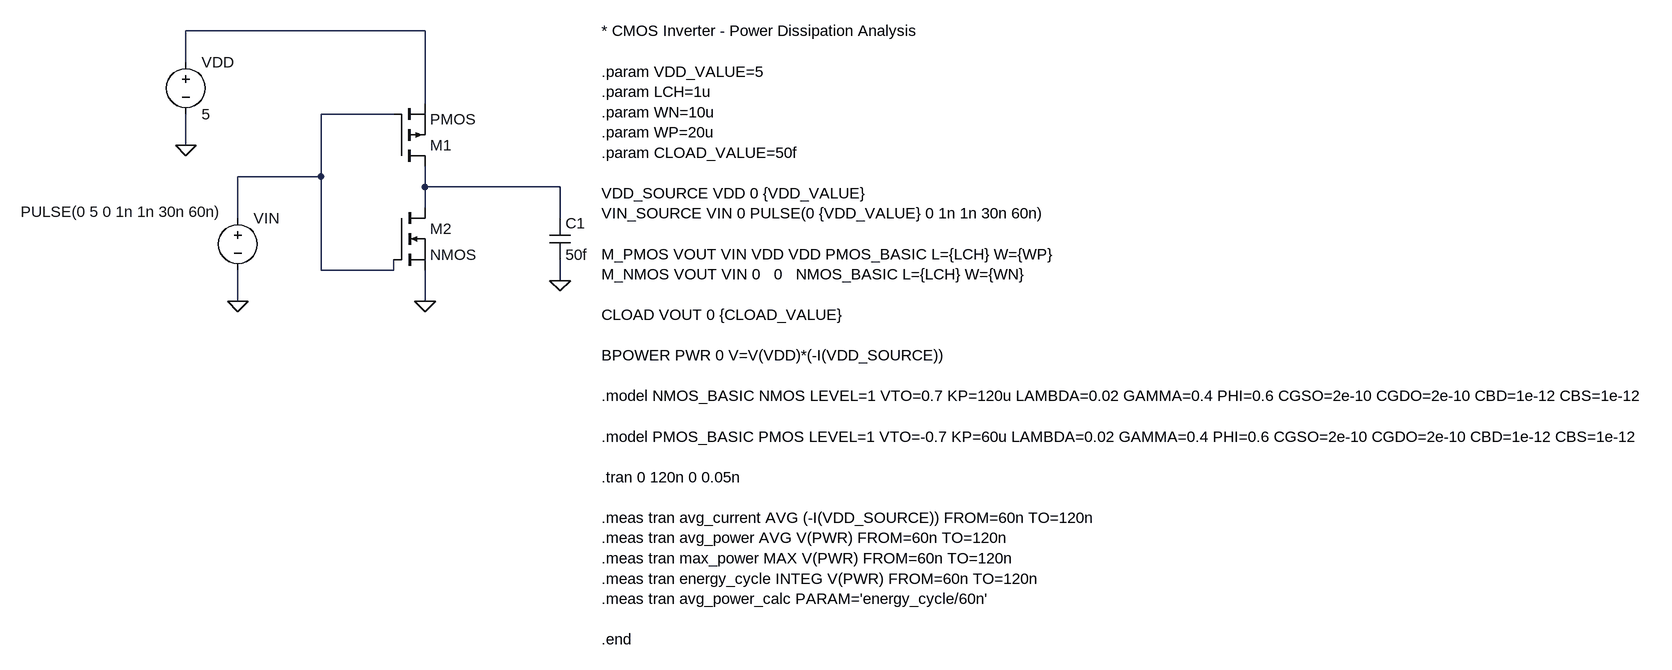
[diagram p0: schematic circuit.asc]
circuit.asc, the LTspice schematic file:
Version 4.1
SHEET 1 2120 776
WIRE 160 -80 -208 -80
WIRE -208 -32 -208 -80
WIRE 160 32 160 -80
WIRE 112 48 0 48
WIRE -208 96 -208 48
WIRE 0 144 0 48
WIRE 0 144 -128 144
WIRE 160 160 160 128
WIRE 368 160 160 160
WIRE 160 192 160 160
WIRE -128 208 -128 144
WIRE 368 208 368 160
WIRE 0 288 0 144
WIRE 112 288 112 272
WIRE 112 288 0 288
WIRE 368 304 368 272
WIRE -128 336 -128 288
WIRE 160 336 160 288
FLAG -208 96 0
FLAG 160 336 0
FLAG -128 336 0
FLAG 368 304 0
SYMBOL pmos 112 128 M180
SYMATTR InstName M1
SYMBOL nmos 112 192 R0
SYMATTR InstName M2
SYMBOL voltage -208 -48 R0
WINDOW 123 0 0 Left 0
WINDOW 39 0 0 Left 0
SYMATTR InstName VDD
SYMATTR Value 5
SYMBOL voltage -128 192 R0
WINDOW 3 -334 6 Left 2
WINDOW 123 0 0 Left 0
WINDOW 39 0 0 Left 0
SYMATTR InstName VIN
SYMATTR Value PULSE(0 5 0 1n 1n 30n 60n)
SYMBOL cap 352 208 R0
SYMATTR InstName C1
SYMATTR Value 50f
TEXT 432 -80 Left 2 !* CMOS Inverter - Power Dissipation Analysis\n \n.param VDD_VALUE=5\n.param LCH=1u\n.param WN=10u\n.param WP=20u\n.param CLOAD_VALUE=50f\n \nVDD_SOURCE VDD 0 {VDD_VALUE}\nVIN_SOURCE VIN 0 PULSE(0 {VDD_VALUE} 0 1n 1n 30n 60n)\n \nM_PMOS VOUT VIN VDD VDD PMOS_BASIC L={LCH} W={WP}\nM_NMOS VOUT VIN 0   0   NMOS_BASIC L={LCH} W={WN}\n \nCLOAD VOUT 0 {CLOAD_VALUE}\n \nBPOWER PWR 0 V=V(VDD)*(-I(VDD_SOURCE))\n \n.model NMOS_BASIC NMOS LEVEL=1 VTO=0.7 KP=120u LAMBDA=0.02 GAMMA=0.4 PHI=0.6 CGSO=2e-10 CGDO=2e-10 CBD=1e-12 CBS=1e-12\n \n.model PMOS_BASIC PMOS LEVEL=1 VTO=-0.7 KP=60u LAMBDA=0.02 GAMMA=0.4 PHI=0.6 CGSO=2e-10 CGDO=2e-10 CBD=1e-12 CBS=1e-12\n \n.tran 0 120n 0 0.05n\n \n.meas tran avg_current AVG (-I(VDD_SOURCE)) FROM=60n TO=120n\n.meas tran avg_power AVG V(PWR) FROM=60n TO=120n\n.meas tran max_power MAX V(PWR) FROM=60n TO=120n\n.meas tran energy_cycle INTEG V(PWR) FROM=60n TO=120n\n.meas tran avg_power_calc PARAM='energy_cycle/60n'\n \n.end

The netlist it stands for:
* circuit.asc
M1 N003 N002 N001 N001 PMOS
M2 N003 N002 0 0 NMOS
VDD N001 0 5
VIN N002 0 PULSE(0 5 0 1n 1n 30n 60n)
C1 N003 0 50f
.model NMOS NMOS
.model PMOS PMOS
.lib standard.mos
* CMOS Inverter - Power Dissipation Analysis
.param VDD_VALUE=5
.param LCH=1u
.param WN=10u
.param WP=20u
.param CLOAD_VALUE=50f
VDD_SOURCE VDD 0 {VDD_VALUE}
VIN_SOURCE VIN 0 PULSE(0 {VDD_VALUE} 0 1n 1n 30n 60n)
M_PMOS VOUT VIN VDD VDD PMOS_BASIC L={LCH} W={WP}
M_NMOS VOUT VIN 0   0   NMOS_BASIC L={LCH} W={WN}
CLOAD VOUT 0 {CLOAD_VALUE}
BPOWER PWR 0 V=V(VDD)*(-I(VDD_SOURCE))
.model NMOS_BASIC NMOS LEVEL=1 VTO=0.7 KP=120u LAMBDA=0.02 GAMMA=0.4 PHI=0.6 CGSO=2e-10 CGDO=2e-10 CBD=1e-12 CBS=1e-12
.model PMOS_BASIC PMOS LEVEL=1 VTO=-0.7 KP=60u LAMBDA=0.02 GAMMA=0.4 PHI=0.6 CGSO=2e-10 CGDO=2e-10 CBD=1e-12 CBS=1e-12
.tran 0 120n 0 0.05n
.meas tran avg_current AVG (-I(VDD_SOURCE)) FROM=60n TO=120n
.meas tran avg_power AVG V(PWR) FROM=60n TO=120n
.meas tran max_power MAX V(PWR) FROM=60n TO=120n
.meas tran energy_cycle INTEG V(PWR) FROM=60n TO=120n
.meas tran avg_power_calc PARAM='energy_cycle/60n'
.end
.backanno
.end